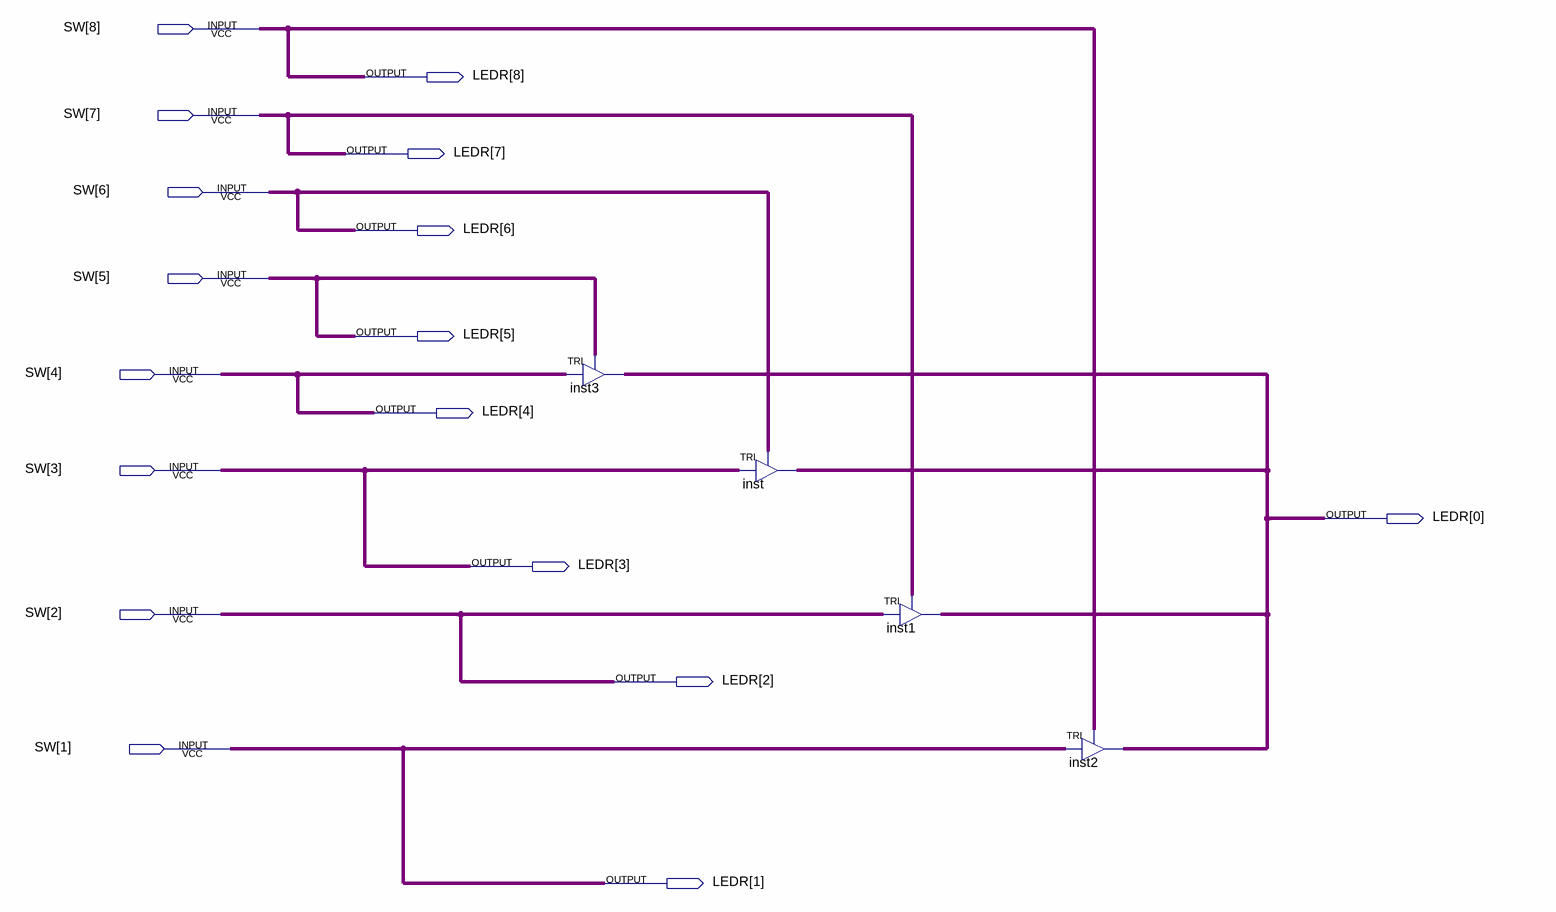
[diagram p0: schematic sheet]
// Quartus schematic Tri-state_buffer.bdf as structural Verilog: 4 symbols, 17 pins
module \Tri-state_buffer  (
  input  [8:1] SW,
  output [8:0] LEDR
);

  TRI inst3 (.IN(SW[4]), .OE(SW[5]), .OUT(LEDR[0]));
  TRI inst (.IN(SW[3]), .OE(SW[6]), .OUT(LEDR[0]));
  TRI inst1 (.IN(SW[2]), .OE(SW[7]), .OUT(LEDR[0]));
  TRI inst2 (.IN(SW[1]), .OE(SW[8]), .OUT(LEDR[0]));

  assign LEDR[8:1] = SW;
endmodule
